# Altium schematic sheet 02_Mcu.SchDoc
size A4
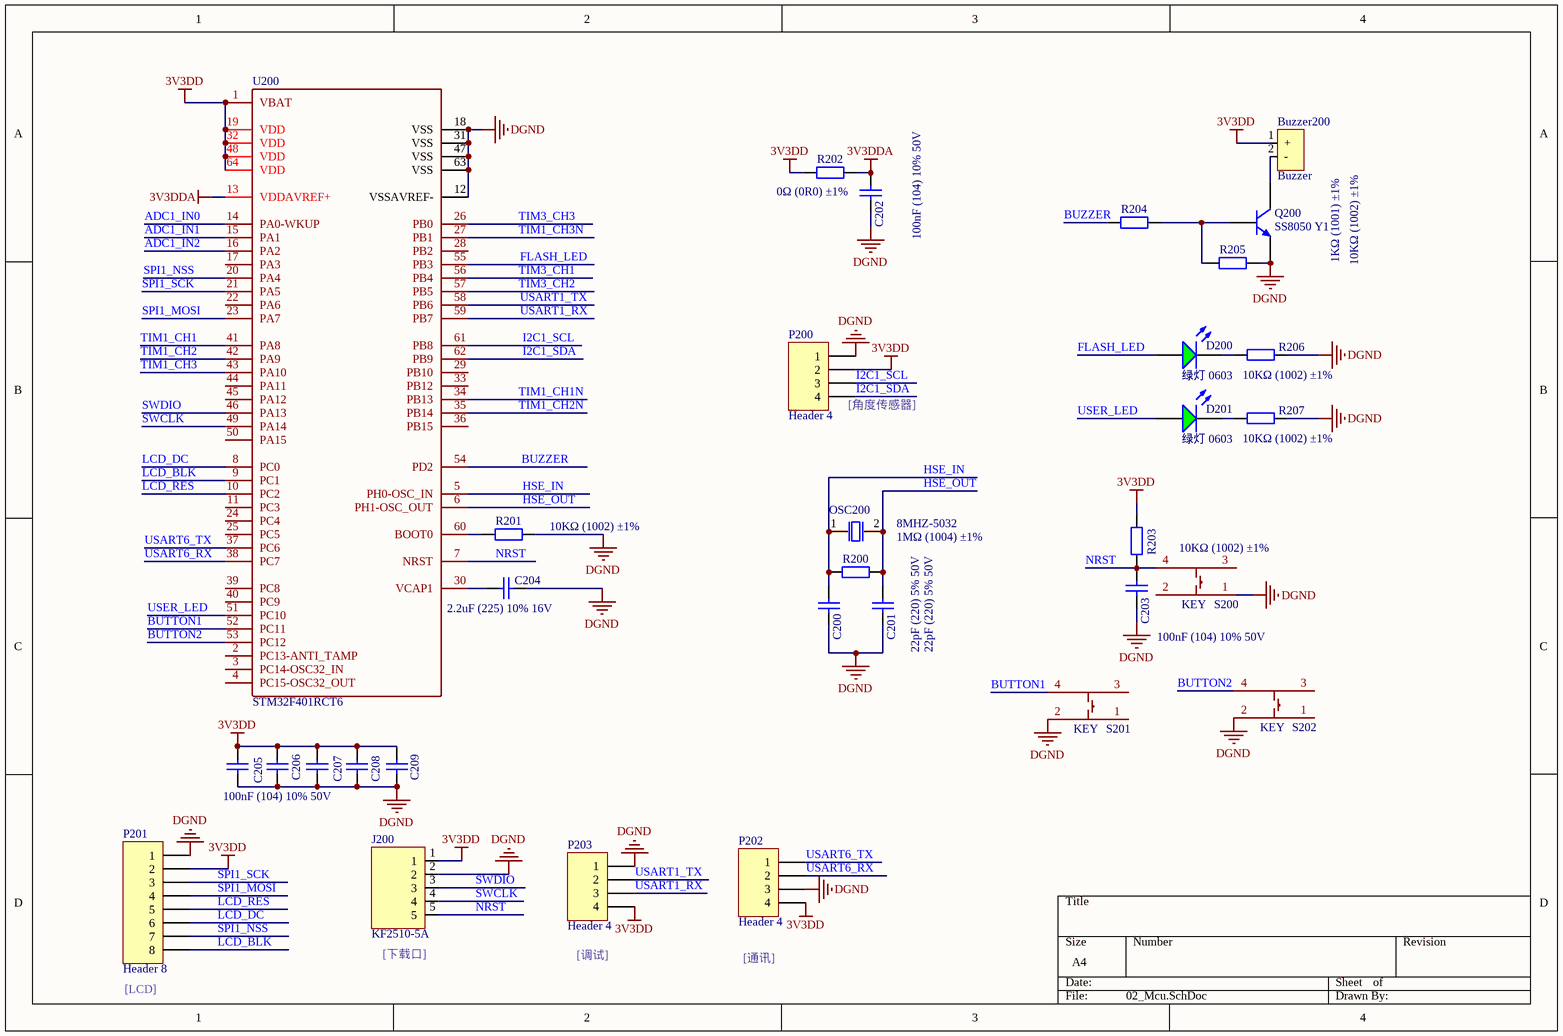
[diagram p0: 02_Mcu.SchDoc]

## Parts
Buzzer200  Buzzer  [buzzer-0905]
C200  22pF (220) 5% 50V  [0603_C]
C201  22pF (220) 5% 50V  [0603_C]
C202  100nF (104) 10% 50V  [0603_C]
C203  100nF (104) 10% 50V  [0603_C]
C204  2.2uF (225) 10% 16V  [0603_C]
C205  100nF (104) 10% 50V  [LC-0603_C]
C206  100nF (104) 10% 50V  [LC-0603_C]  (value not drawn)
C207  100nF (104) 10% 50V  [LC-0603_C]  (value not drawn)
C208  100nF (104) 10% 50V  [LC-0603_C]  (value not drawn)
C209  100nF (104) 10% 50V  [LC-0603_C]  (value not drawn)
D200  绿灯 0603  [0603_LED_S1]
D201  绿灯 0603  [0603_LED_S1]
J200  KF2510-5A  [KF2510-5A]
OSC200  8MHZ-5032  [8MHZ-5032]
P200  Header 4  [HDR1X4]
P201  Header 8  [HDR1X8]
P202  Header 4  [HDR1X4]
P203  Header 4  [HDR1X4]
Q200  SS8050 Y1  [SOT-23(SOT-23-3)]
R200  1MΩ (1004) ±1%  [0603_R]
R201  10KΩ (1002) ±1%  [0603_R]
R202  0Ω (0R0) ±1%  [0603_R]
R203  10KΩ (1002) ±1%  [0603_R]
R204  1KΩ (1001) ±1%  [0603_R]
R205  10KΩ (1002) ±1%  [0603_R]
R206  10KΩ (1002) ±1%  [0603_R]
R207  10KΩ (1002) ±1%  [0603_R]
S200  KEY  [KEY_WHITE]
S201  KEY  [KEY_WHITE]
S202  KEY  [KEY_WHITE]
U200  STM32F401RCT6  [STM32F401RCT6]

## Nets
3V3DD: Buzzer200.1(+) C205.2 C206.2 C207.2 C208.2 C209.2 J200.1 P200.2 P201.2 P202.4 P203.4 R202.1 R203.2 U200.1(VBAT) U200.19(VDD) U200.32(VDD) U200.48(VDD) U200.64(VDD)
3V3DDA: C202.2 R202.2 U200.13(VDDAVREF+)
DGND: C200.1 C201.1 C202.1 C203.1 C204.2 C205.1 C206.1 C207.1 C208.1 C209.1 J200.2 P200.1 P201.1 P202.3 P203.1 Q200.2(E) R201.2 R205.2 R206.2 R207.2 S200.1 S201.2 S202.2 U200.12(VSSAVREF-) U200.18(VSS) U200.31(VSS) U200.47(VSS) U200.63(VSS)
ADC1_IN0: U200.14(PA0-WKUP)
ADC1_IN1: U200.15(PA1)
ADC1_IN2: U200.16(PA2)
BUTTON1: S201.4 U200.52(PC11)
BUTTON2: S202.4 U200.53(PC12)
BUZZER: R204.1 U200.54(PD2)
FLASH_LED: D200.A U200.55(PB3)
HSE_IN: C200.2 OSC200.1(OSC1) R200.1 U200.5(PH0-OSC_IN)
HSE_OUT: C201.2 OSC200.2(OSC2) R200.2 U200.6(PH1-OSC_OUT)
I2C1_SCL: P200.3 U200.61(PB8)
I2C1_SDA: P200.4 U200.62(PB9)
LCD_BLK: P201.8 U200.9(PC1)
LCD_DC: P201.6 U200.8(PC0)
LCD_RES: P201.5 U200.10(PC2)
NRST: C203.2 J200.5 R203.1 S200.4 U200.7(NRST)
SPI1_MOSI: P201.4 U200.23(PA7)
SPI1_NSS: P201.7 U200.20(PA4)
SPI1_SCK: P201.3 U200.21(PA5)
SWCLK: J200.4 U200.49(PA14)
SWDIO: J200.3 U200.46(PA13)
TIM1_CH1: U200.41(PA8)
TIM1_CH1N: U200.34(PB13)
TIM1_CH2: U200.42(PA9)
TIM1_CH2N: U200.35(PB14)
TIM1_CH3: U200.43(PA10)
TIM1_CH3N: U200.27(PB1)
TIM3_CH1: U200.56(PB4)
TIM3_CH2: U200.57(PB5)
TIM3_CH3: U200.26(PB0)
USART1_RX: P203.3 U200.59(PB7)
USART1_TX: P203.2 U200.58(PB6)
USART6_RX: P202.2 U200.38(PC7)
USART6_TX: P202.1 U200.37(PC6)
USER_LED: D201.A U200.51(PC10)
NetBuzzer200_2: Buzzer200.2(-) Q200.3(C)
NetC204_1: C204.1 U200.30(VCAP1)
NetD200_K: D200.K R206.1
NetD201_K: D201.K R207.1
NetQ200_1: Q200.1(B) R204.2 R205.1
NetR201_1: R201.1 U200.60(BOOT0)

Not connected (* = marked no-connect by the designer): S200 2 3; S201 1 3; S202 1 3; U200 2(PC13-ANTI_TAMP) 3(PC14-OSC32_IN) 4(PC15-OSC32_OUT) 11(PC3) 17(PA3) 22(PA6) 24(PC4) 25(PC5) 28(PB2) 29(PB10) 33(PB12) 36(PB15) 39(PC8) 40(PC9) 44(PA11) 45(PA12) 50(PA15)

## Notes on the sheet
- (near P200) [角度传感器]
- (near J200) [下载口]
- (near P203) [调试]
- (near P202) [通讯]
- (near P201) [LCD]

## Library data of the parts
C200 C201 = 0603 22pF (220) 5% 50V: 贴片电容; ComponentLink1Description: 供应商链接; ComponentLink1URL: http://www.szlcsc.com/product/details_2005.html; Package: 0603; Supplier: LC; SuppliersPartNumber: C1653
C202 C203 C205-C209 = 0603 100nF (104) 10% 50V: 贴片电容; ComponentLink1Description: 供应商链接; ComponentLink1URL: http://www.szlcsc.com/product/details_15331.html; Package: 0603; Supplier: LC; SuppliersPartNumber: C14663
C204 = 0603 2.2uF (225) 10% 16V: 贴片电容; ComponentLink1Description: 供应商链接; ComponentLink1URL: http://www.szlcsc.com/product/details_24366.html; Package: 0603; Supplier: LC; SuppliersPartNumber: C23630
D200 D201 = 0603 绿灯: 发光二极管; ComponentLink1Description: 供应商链接; ComponentLink1URL: http://www.szlcsc.com/product/details_73152.html; Package: 0603; Supplier: LC; SuppliersPartNumber: C72043
P200 P202 P203 = Header 4: Header, 4-Pin; LatestRevisionDate: 17-Jul-2002; LatestRevisionNote: Re-released for DXP Platform.; Publisher: Altium Limited
P201 = Header 8: Header, 8-Pin; LatestRevisionDate: 17-Jul-2002; LatestRevisionNote: Re-released for DXP Platform.; Publisher: Altium Limited
Q200 = SOT-23 SS8050 Y1: 三极管; ComponentLink1Description: 供应商链接; ComponentLink1URL: http://www.szlcsc.com/product/details_2507.html; Package: SOT-23; Supplier: LC; SuppliersPartNumber: C2150
R200 = 0603 1MΩ (1004) 1%: 贴片电阻; ComponentLink1Description: 供应商链接; ComponentLink1URL: http://www.szlcsc.com/product/details_23662.html; Package: 0603; Supplier: LC; SuppliersPartNumber: C22935
R201 R203 R205-R207 = 0603 10KΩ (1002) 1%: 贴片电阻; ComponentLink1Description: 供应商链接; ComponentLink1URL: http://www.szlcsc.com/product/details_26547.html; Package: 0603; Supplier: LC; SuppliersPartNumber: C25804
R202 = 0603 0Ω (0R0) 1%: 贴片电阻; ComponentLink1Description: 供应商链接; ComponentLink1URL: http://www.szlcsc.com/product/details_21903.html; Package: 0603; Supplier: LC; SuppliersPartNumber: C21189
R204 = 0603 1KΩ (1001) 1%: 贴片电阻; ComponentLink1Description: 供应商链接; ComponentLink1URL: http://www.szlcsc.com/product/details_21904.html; Package: 0603; Supplier: LC; SuppliersPartNumber: C21190
S200-S202 = KEY: 白色方块